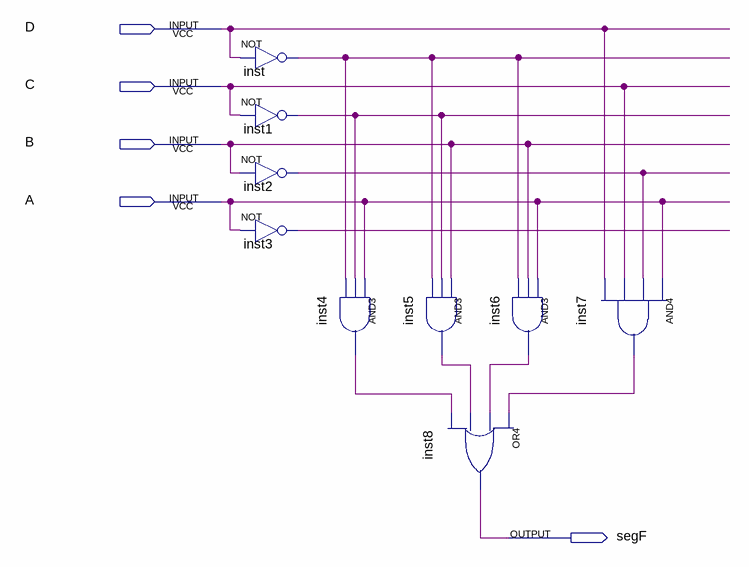
[diagram p0: schematic sheet]
// Quartus schematic segF.bdf as structural Verilog: 9 symbols, 5 pins
module segF (
  input  D,
  input  C,
  input  B,
  input  A,
  output segF
);

  wire inst1_out, inst2_out, inst3_out, inst4_out, inst5_out, inst6_out, inst7_out, inst_out;

  not inst (inst_out, D);
  not inst1 (inst1_out, C);
  not inst2 (inst2_out, B);
  not inst3 (inst3_out, A);
  and inst4 (inst4_out, A, inst1_out, inst_out);
  and inst5 (inst5_out, B, inst1_out, inst_out);
  or inst8 (segF, inst7_out, inst6_out, inst5_out, inst4_out);
  and inst6 (inst6_out, A, B, inst_out);
  and inst7 (inst7_out, A, inst2_out, C, D);
endmodule
